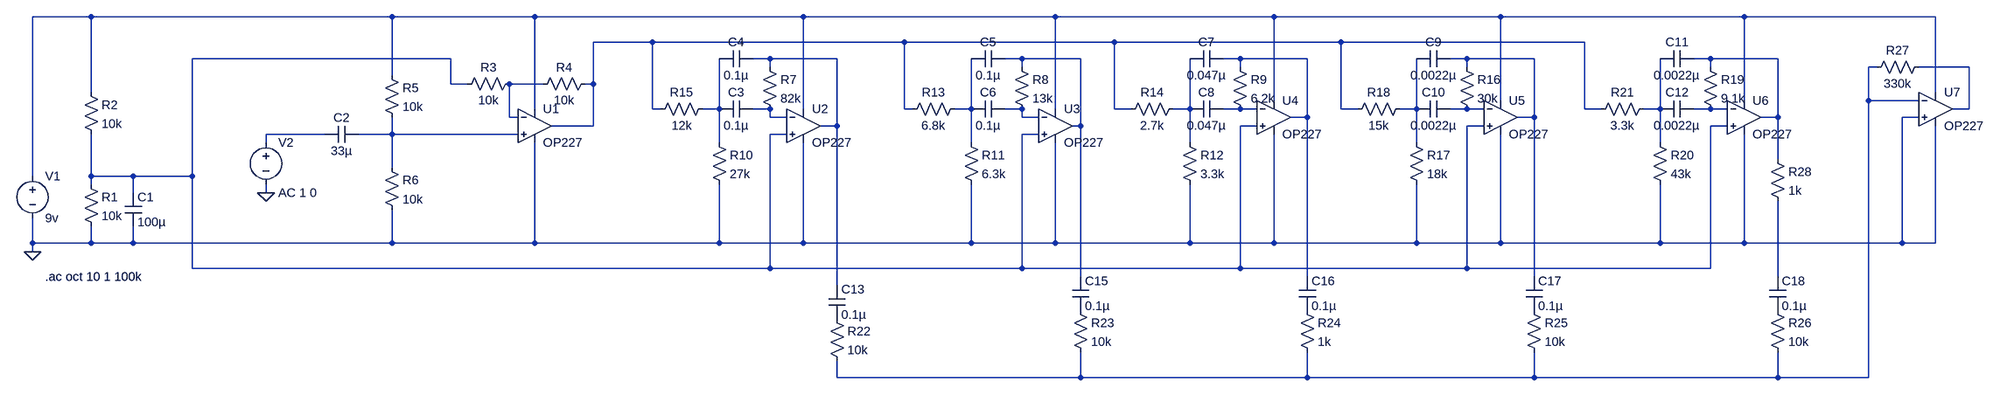
[diagram p0: schematic Equilizer.asc]
Equilizer.asc, the LTspice schematic file:
Version 4
SHEET 1 2676 680
WIRE -912 -176 -1024 -176
WIRE -336 -176 -912 -176
WIRE -64 -176 -336 -176
WIRE 448 -176 -64 -176
WIRE 928 -176 448 -176
WIRE 1344 -176 928 -176
WIRE 1776 -176 1344 -176
WIRE 2240 -176 1776 -176
WIRE 2608 -176 2240 -176
WIRE 160 -128 48 -128
WIRE 640 -128 160 -128
WIRE 1040 -128 640 -128
WIRE 1472 -128 1040 -128
WIRE 1936 -128 1472 -128
WIRE -224 -96 -720 -96
WIRE 384 -96 352 -96
WIRE 512 -96 384 -96
WIRE 864 -96 832 -96
WIRE 976 -96 864 -96
WIRE 1280 -96 1248 -96
WIRE 1408 -96 1280 -96
WIRE 1712 -96 1680 -96
WIRE 1840 -96 1712 -96
WIRE 2176 -96 2144 -96
WIRE 2304 -96 2176 -96
WIRE 384 -80 384 -96
WIRE 864 -80 864 -96
WIRE 1280 -80 1280 -96
WIRE 1712 -80 1712 -96
WIRE 2176 -80 2176 -96
WIRE 2496 -80 2480 -80
WIRE 2672 -80 2576 -80
WIRE -336 -64 -336 -176
WIRE -224 -48 -224 -96
WIRE -192 -48 -224 -48
WIRE -48 -48 -112 -48
WIRE 48 -48 48 -128
WIRE 48 -48 32 -48
WIRE -912 -32 -912 -176
WIRE 2608 -32 2608 -176
WIRE 1344 -16 1344 -176
WIRE 1776 -16 1776 -176
WIRE 2240 -16 2240 -176
WIRE 2480 -16 2480 -80
WIRE 2576 -16 2480 -16
WIRE -64 0 -64 -176
WIRE 160 0 160 -128
WIRE 176 0 160 0
WIRE 288 0 288 -96
WIRE 288 0 256 0
WIRE 384 0 352 0
WIRE 448 0 448 -176
WIRE 640 0 640 -128
WIRE 656 0 640 0
WIRE 768 0 768 -96
WIRE 768 0 736 0
WIRE 864 0 832 0
WIRE 928 0 928 -176
WIRE 1040 0 1040 -128
WIRE 1072 0 1040 0
WIRE 1184 0 1184 -96
WIRE 1184 0 1152 0
WIRE 1280 0 1248 0
WIRE 1312 0 1280 0
WIRE 1472 0 1472 -128
WIRE 1504 0 1472 0
WIRE 1616 0 1616 -96
WIRE 1616 0 1584 0
WIRE 1712 0 1680 0
WIRE 1744 0 1712 0
WIRE 1936 0 1936 -128
WIRE 1968 0 1936 0
WIRE 2080 0 2080 -96
WIRE 2080 0 2048 0
WIRE 2176 0 2144 0
WIRE 2208 0 2176 0
WIRE 2672 0 2672 -80
WIRE 2672 0 2640 0
WIRE -112 16 -112 -48
WIRE -96 16 -112 16
WIRE 384 16 384 0
WIRE 416 16 384 16
WIRE 864 16 864 0
WIRE 896 16 864 16
WIRE 1408 16 1408 -96
WIRE 1408 16 1376 16
WIRE 1840 16 1840 -96
WIRE 1840 16 1808 16
WIRE 2304 16 2304 -96
WIRE 2304 16 2272 16
WIRE 2576 16 2544 16
WIRE 48 32 48 -48
WIRE 48 32 -32 32
WIRE 512 32 512 -96
WIRE 512 32 480 32
WIRE 976 32 976 -96
WIRE 976 32 960 32
WIRE 1312 32 1280 32
WIRE 1744 32 1712 32
WIRE 2208 32 2176 32
WIRE -464 48 -576 48
WIRE -336 48 -336 16
WIRE -336 48 -400 48
WIRE -96 48 -336 48
WIRE 416 48 384 48
WIRE 896 48 864 48
WIRE -576 64 -576 48
WIRE 288 64 288 0
WIRE 768 64 768 0
WIRE 1184 64 1184 0
WIRE 1616 64 1616 0
WIRE 2080 64 2080 0
WIRE 2304 96 2304 16
WIRE -336 112 -336 48
WIRE -1024 128 -1024 -176
WIRE -912 128 -912 48
WIRE -832 128 -912 128
WIRE -720 128 -720 -96
WIRE -720 128 -832 128
WIRE -912 144 -912 128
WIRE -832 160 -832 128
WIRE -576 160 -576 144
WIRE -1024 256 -1024 208
WIRE -912 256 -912 224
WIRE -912 256 -1024 256
WIRE -832 256 -832 224
WIRE -832 256 -912 256
WIRE -336 256 -336 192
WIRE -336 256 -832 256
WIRE -64 256 -64 64
WIRE -64 256 -336 256
WIRE 288 256 288 144
WIRE 288 256 -64 256
WIRE 448 256 448 64
WIRE 448 256 288 256
WIRE 768 256 768 144
WIRE 768 256 448 256
WIRE 928 256 928 64
WIRE 928 256 768 256
WIRE 1184 256 1184 144
WIRE 1184 256 928 256
WIRE 1344 256 1344 48
WIRE 1344 256 1184 256
WIRE 1616 256 1616 144
WIRE 1616 256 1344 256
WIRE 1776 256 1776 48
WIRE 1776 256 1616 256
WIRE 2080 256 2080 144
WIRE 2080 256 1776 256
WIRE 2240 256 2240 48
WIRE 2240 256 2080 256
WIRE 2544 256 2544 16
WIRE 2544 256 2240 256
WIRE 2608 256 2608 32
WIRE 2608 256 2544 256
WIRE -1024 272 -1024 256
WIRE -720 304 -720 128
WIRE 384 304 384 48
WIRE 384 304 -720 304
WIRE 864 304 864 48
WIRE 864 304 384 304
WIRE 1280 304 1280 32
WIRE 1280 304 864 304
WIRE 1712 304 1712 32
WIRE 1712 304 1280 304
WIRE 2176 304 2176 32
WIRE 2176 304 1712 304
WIRE 976 320 976 32
WIRE 1408 320 1408 16
WIRE 1840 320 1840 16
WIRE 2304 320 2304 176
WIRE 512 336 512 32
WIRE 512 512 512 480
WIRE 976 512 976 464
WIRE 976 512 512 512
WIRE 1408 512 1408 464
WIRE 1408 512 976 512
WIRE 1840 512 1840 464
WIRE 1840 512 1408 512
WIRE 2304 512 2304 464
WIRE 2304 512 1840 512
WIRE 2480 512 2480 -16
WIRE 2480 512 2304 512
FLAG -1024 272 0
FLAG -576 160 0
SYMBOL OpAmps\\OP227 -64 -32 R0
SYMATTR InstName U1
SYMBOL voltage -1024 112 R0
WINDOW 123 0 0 Left 0
WINDOW 39 0 0 Left 0
SYMATTR InstName V1
SYMATTR Value 9v
SYMBOL res -928 128 R0
SYMATTR InstName R1
SYMATTR Value 10k
SYMBOL res -928 -48 R0
SYMATTR InstName R2
SYMATTR Value 10k
SYMBOL cap -848 160 R0
SYMATTR InstName C1
SYMATTR Value 100µ
SYMBOL res -96 -64 R90
WINDOW 0 0 56 VBottom 2
WINDOW 3 32 56 VTop 2
SYMATTR InstName R3
SYMATTR Value 10k
SYMBOL res 48 -64 R90
WINDOW 0 0 56 VBottom 2
WINDOW 3 32 56 VTop 2
SYMATTR InstName R4
SYMATTR Value 10k
SYMBOL res -352 -80 R0
SYMATTR InstName R5
SYMATTR Value 10k
SYMBOL res -352 96 R0
SYMATTR InstName R6
SYMATTR Value 10k
SYMBOL cap -400 32 R90
WINDOW 0 0 32 VBottom 2
WINDOW 3 32 32 VTop 2
SYMATTR InstName C2
SYMATTR Value 33µ
SYMBOL voltage -576 48 R0
WINDOW 123 24 112 Left 2
WINDOW 39 0 0 Left 0
SYMATTR Value2 AC 1 0
SYMATTR InstName V2
SYMATTR Value ""
SYMBOL OpAmps\\OP227 448 -32 R0
SYMATTR InstName U2
SYMBOL OpAmps\\OP227 928 -32 R0
SYMATTR InstName U3
SYMBOL OpAmps\\OP227 1344 -48 R0
SYMATTR InstName U4
SYMBOL res 368 -96 R0
SYMATTR InstName R7
SYMATTR Value 82k
SYMBOL res 848 -96 R0
SYMATTR InstName R8
SYMATTR Value 13k
SYMBOL res 1264 -96 R0
SYMATTR InstName R9
SYMATTR Value 6.2k
SYMBOL cap 352 -16 R90
WINDOW 0 0 32 VBottom 2
WINDOW 3 32 32 VTop 2
SYMATTR InstName C3
SYMATTR Value 0.1µ
SYMBOL cap 352 -112 R90
WINDOW 0 0 32 VBottom 2
WINDOW 3 32 32 VTop 2
SYMATTR InstName C4
SYMATTR Value 0.1µ
SYMBOL cap 832 -112 R90
WINDOW 0 0 32 VBottom 2
WINDOW 3 32 32 VTop 2
SYMATTR InstName C5
SYMATTR Value 0.1µ
SYMBOL cap 832 -16 R90
WINDOW 0 0 32 VBottom 2
WINDOW 3 32 32 VTop 2
SYMATTR InstName C6
SYMATTR Value 0.1µ
SYMBOL cap 1248 -112 R90
WINDOW 0 0 32 VBottom 2
WINDOW 3 32 32 VTop 2
SYMATTR InstName C7
SYMATTR Value 0.047µ
SYMBOL cap 1248 -16 R90
WINDOW 0 0 32 VBottom 2
WINDOW 3 32 32 VTop 2
SYMATTR InstName C8
SYMATTR Value 0.047µ
SYMBOL res 272 48 R0
SYMATTR InstName R10
SYMATTR Value 27k
SYMBOL res 752 48 R0
SYMATTR InstName R11
SYMATTR Value 6.3k
SYMBOL res 1168 48 R0
SYMATTR InstName R12
SYMATTR Value 3.3k
SYMBOL res 752 -16 R90
WINDOW 0 0 56 VBottom 2
WINDOW 3 32 56 VTop 2
SYMATTR InstName R13
SYMATTR Value 6.8k
SYMBOL res 1168 -16 R90
WINDOW 0 0 56 VBottom 2
WINDOW 3 32 56 VTop 2
SYMATTR InstName R14
SYMATTR Value 2.7k
SYMBOL res 272 -16 R90
WINDOW 0 0 56 VBottom 2
WINDOW 3 32 56 VTop 2
SYMATTR InstName R15
SYMATTR Value 12k
SYMBOL OpAmps\\OP227 1776 -48 R0
SYMATTR InstName U5
SYMBOL res 1696 -96 R0
SYMATTR InstName R16
SYMATTR Value 30k
SYMBOL cap 1680 -112 R90
WINDOW 0 0 32 VBottom 2
WINDOW 3 32 32 VTop 2
SYMATTR InstName C9
SYMATTR Value 0.0022µ
SYMBOL cap 1680 -16 R90
WINDOW 0 0 32 VBottom 2
WINDOW 3 32 32 VTop 2
SYMATTR InstName C10
SYMATTR Value 0.0022µ
SYMBOL res 1600 48 R0
SYMATTR InstName R17
SYMATTR Value 18k
SYMBOL res 1600 -16 R90
WINDOW 0 0 56 VBottom 2
WINDOW 3 32 56 VTop 2
SYMATTR InstName R18
SYMATTR Value 15k
SYMBOL OpAmps\\OP227 2240 -48 R0
SYMATTR InstName U6
SYMBOL res 2160 -96 R0
SYMATTR InstName R19
SYMATTR Value 9.1k
SYMBOL cap 2144 -112 R90
WINDOW 0 0 32 VBottom 2
WINDOW 3 32 32 VTop 2
SYMATTR InstName C11
SYMATTR Value 0.0022µ
SYMBOL cap 2144 -16 R90
WINDOW 0 0 32 VBottom 2
WINDOW 3 32 32 VTop 2
SYMATTR InstName C12
SYMATTR Value 0.0022µ
SYMBOL res 2064 48 R0
SYMATTR InstName R20
SYMATTR Value 43k
SYMBOL res 2064 -16 R90
WINDOW 0 0 56 VBottom 2
WINDOW 3 32 56 VTop 2
SYMATTR InstName R21
SYMATTR Value 3.3k
SYMBOL cap 496 336 R0
SYMATTR InstName C13
SYMATTR Value 0.1µ
SYMBOL cap 960 320 R0
SYMATTR InstName C15
SYMATTR Value 0.1µ
SYMBOL cap 1392 320 R0
SYMATTR InstName C16
SYMATTR Value 0.1µ
SYMBOL cap 1824 320 R0
SYMATTR InstName C17
SYMATTR Value 0.1µ
SYMBOL cap 2288 320 R0
SYMATTR InstName C18
SYMATTR Value 0.1µ
SYMBOL res 496 384 R0
SYMATTR InstName R22
SYMATTR Value 10k
SYMBOL res 960 368 R0
SYMATTR InstName R23
SYMATTR Value 10k
SYMBOL res 1392 368 R0
SYMATTR InstName R24
SYMATTR Value 1k
SYMBOL res 1824 368 R0
SYMATTR InstName R25
SYMATTR Value 10k
SYMBOL OpAmps\\OP227 2608 -64 R0
SYMATTR InstName U7
SYMBOL res 2592 -96 R90
WINDOW 0 0 56 VBottom 2
WINDOW 3 32 56 VTop 2
SYMATTR InstName R27
SYMATTR Value 330k
SYMBOL res 2288 80 R0
SYMATTR InstName R28
SYMATTR Value 1k
SYMBOL res 2288 368 R0
SYMATTR InstName R26
SYMATTR Value 10k
TEXT -1000 320 Left 2 !.ac oct 10 1 100k

The netlist it stands for:
* Equilizer.asc
XU1 N023 N011 N001 0 N002 OP227  ; pins In+ In- V+ V- OUT
V1 N001 0 9v
R1 N003 0 10k
R2 N001 N003 10k
C1 N003 0 100µ
R3 N011 N003 10k
R4 N002 N011 10k
R5 N001 N023 10k
R6 N023 0 10k
C2 N023 N022 33µ
V2 N022 0 AC 1 0
XU2 N003 N013 N001 0 N004 OP227  ; pins In+ In- V+ V- OUT
XU3 N003 N015 N001 0 N005 OP227  ; pins In+ In- V+ V- OUT
XU4 N003 N017 N001 0 N006 OP227  ; pins In+ In- V+ V- OUT
R7 N004 N013 82k
R8 N005 N015 13k
R9 N006 N017 6.2k
C3 N013 N012 0.1µ
C4 N004 N012 0.1µ
C5 N005 N014 0.1µ
C6 N015 N014 0.1µ
C7 N006 N016 0.047µ
C8 N017 N016 0.047µ
R10 N012 0 27k
R11 N014 0 6.3k
R12 N016 0 3.3k
R13 N014 N002 6.8k
R14 N016 N002 2.7k
R15 N012 N002 12k
XU5 N003 N019 N001 0 N007 OP227  ; pins In+ In- V+ V- OUT
R16 N007 N019 30k
C9 N007 N018 0.0022µ
C10 N019 N018 0.0022µ
R17 N018 0 18k
R18 N018 N002 15k
XU6 N003 N021 N001 0 N008 OP227  ; pins In+ In- V+ V- OUT
R19 N008 N021 9.1k
C11 N008 N020 0.0022µ
C12 N021 N020 0.0022µ
R20 N020 0 43k
R21 N020 N002 3.3k
C13 N004 P001 0.1µ
C15 N005 P002 0.1µ
C16 N006 P003 0.1µ
C17 N007 P004 0.1µ
C18 N024 P005 0.1µ
R22 P001 N009 10k
R23 P002 N009 10k
R24 P003 N009 1k
R25 P004 N009 10k
XU7 0 N009 N001 0 N010 OP227  ; pins In+ In- V+ V- OUT
R27 N010 N009 330k
R28 N008 N024 1k
R26 P005 N009 10k
.ac oct 10 1 100k
.backanno
.end